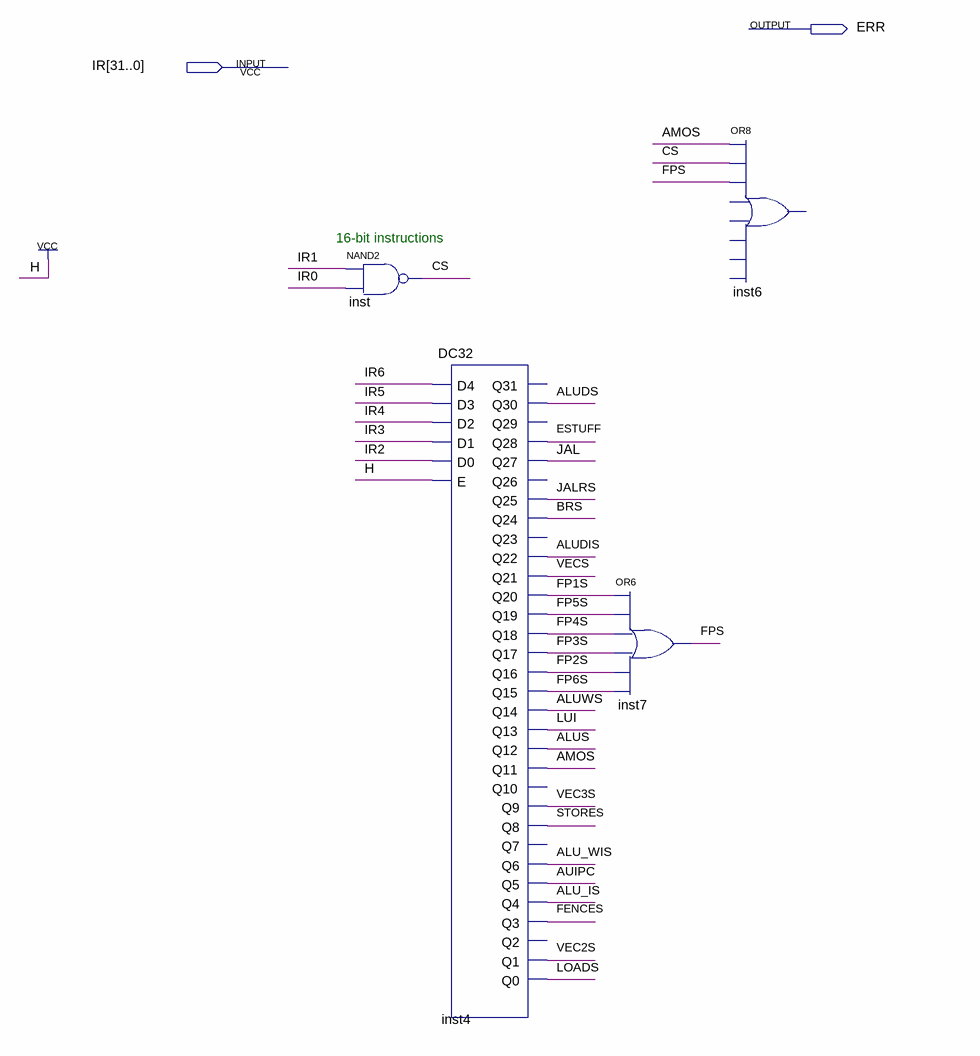
[diagram p0: schematic sheet]
// Quartus schematic Decoder.bdf as structural Verilog: 4 symbols, 2 pins
module Decoder (
  input  [31:0] IR,
  output ERR
);

  wire ALU_IS, ALU_WIS, ALUDIS, ALUDS, ALUS, ALUWS, AMOS, AUIPC, BRS, CS, ESTUFF, FENCES, FP1S, FP2S, FP3S,
       FP4S, FP5S, FP6S, FPS, JAL, JALRS, LOADS, LUI, STORES, VEC2S, VEC3S, VECS;

  nand inst (CS, IR[1], IR[0]);
  DC32 inst4 (
    .D4(IR[6]), .D3(IR[5]), .D2(IR[4]), .D1(IR[3]), .D0(IR[2]), .E(1'b1), .Q30(ALUDS), .Q28(ESTUFF),
    .Q27(JAL), .Q25(JALRS), .Q24(BRS), .Q22(ALUDIS), .Q21(VECS), .Q20(FP1S), .Q19(FP5S), .Q18(FP4S),
    .Q17(FP3S), .Q16(FP2S), .Q15(FP6S), .Q14(ALUWS), .Q13(LUI), .Q12(ALUS), .Q11(AMOS), .Q9(VEC3S),
    .Q8(STORES), .Q6(ALU_WIS), .Q5(AUIPC), .Q4(ALU_IS), .Q3(FENCES), .Q1(VEC2S), .Q0(LOADS));  // open: Q31, Q29, Q26, Q23, Q10, Q7, Q2
  or inst7 (FPS, FP1S, FP5S, FP4S, FP3S, FP2S, FP6S);
  // OR8 inst6 has open pins: IN1=AMOS, IN2=CS, IN3=FPS, IN4=open, IN5=open, IN6=open, IN7=open, IN8=open, OUT=open

  // Notes on the sheet:
  //   16-bit instructions
endmodule
